# EAGLE schematic NervousSys_V2 (EAGLE 8.5.0)
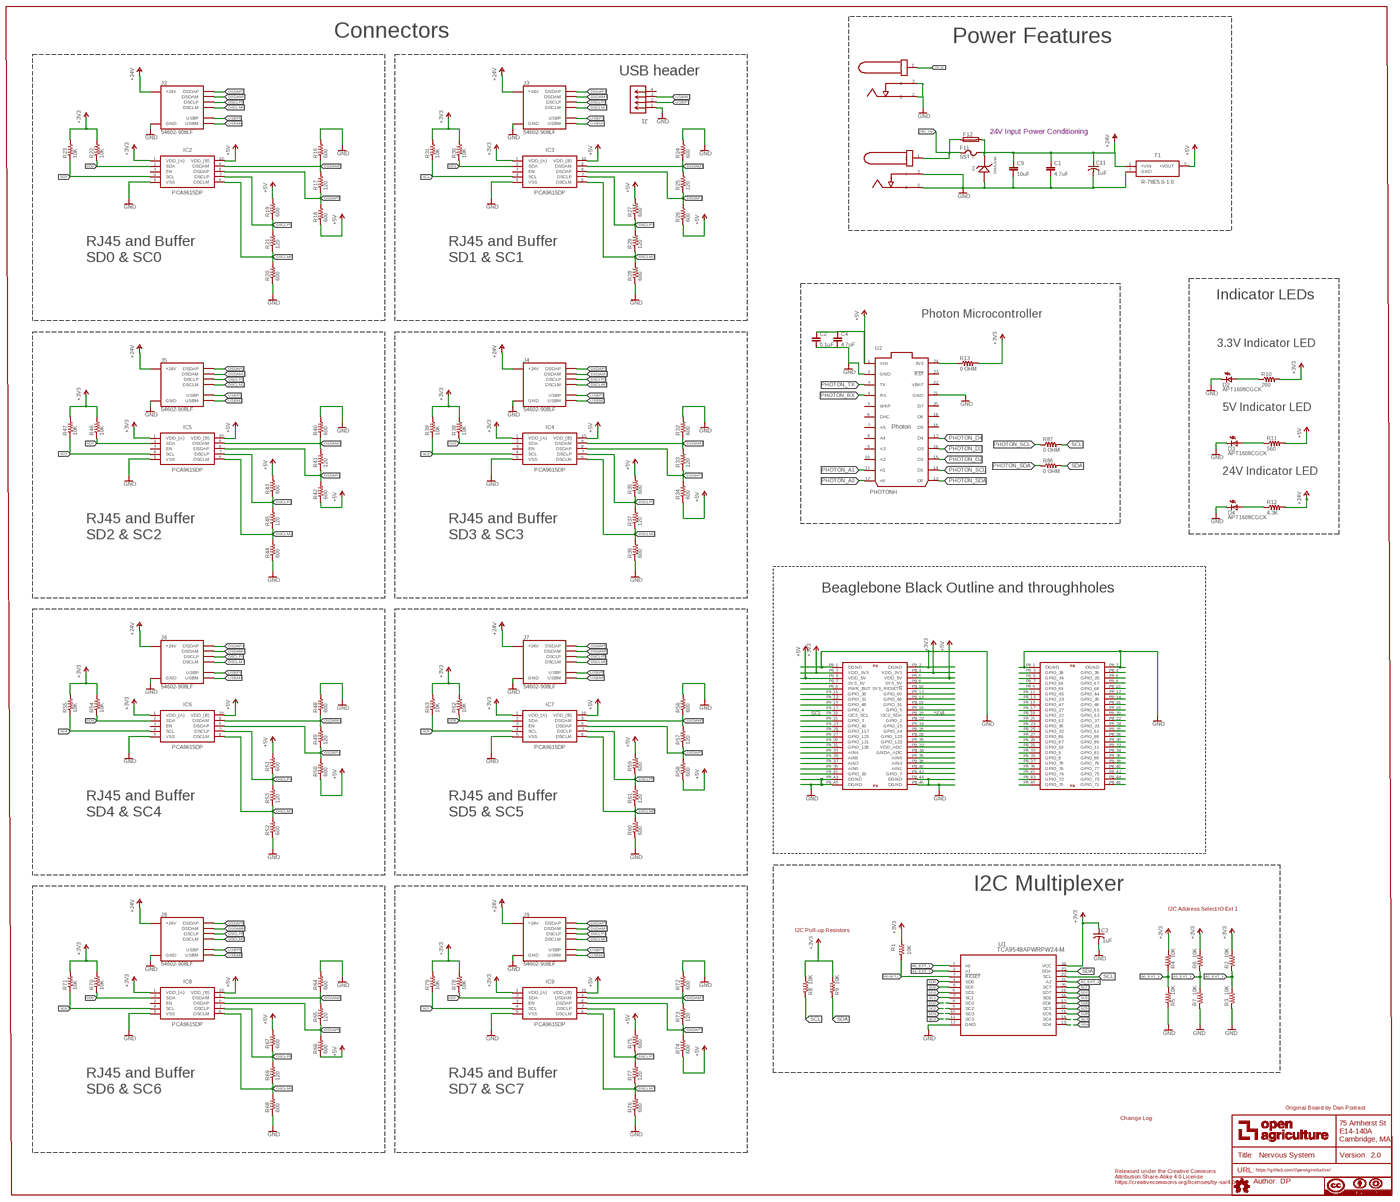
[diagram p0: schematic, sheet 1, overview]
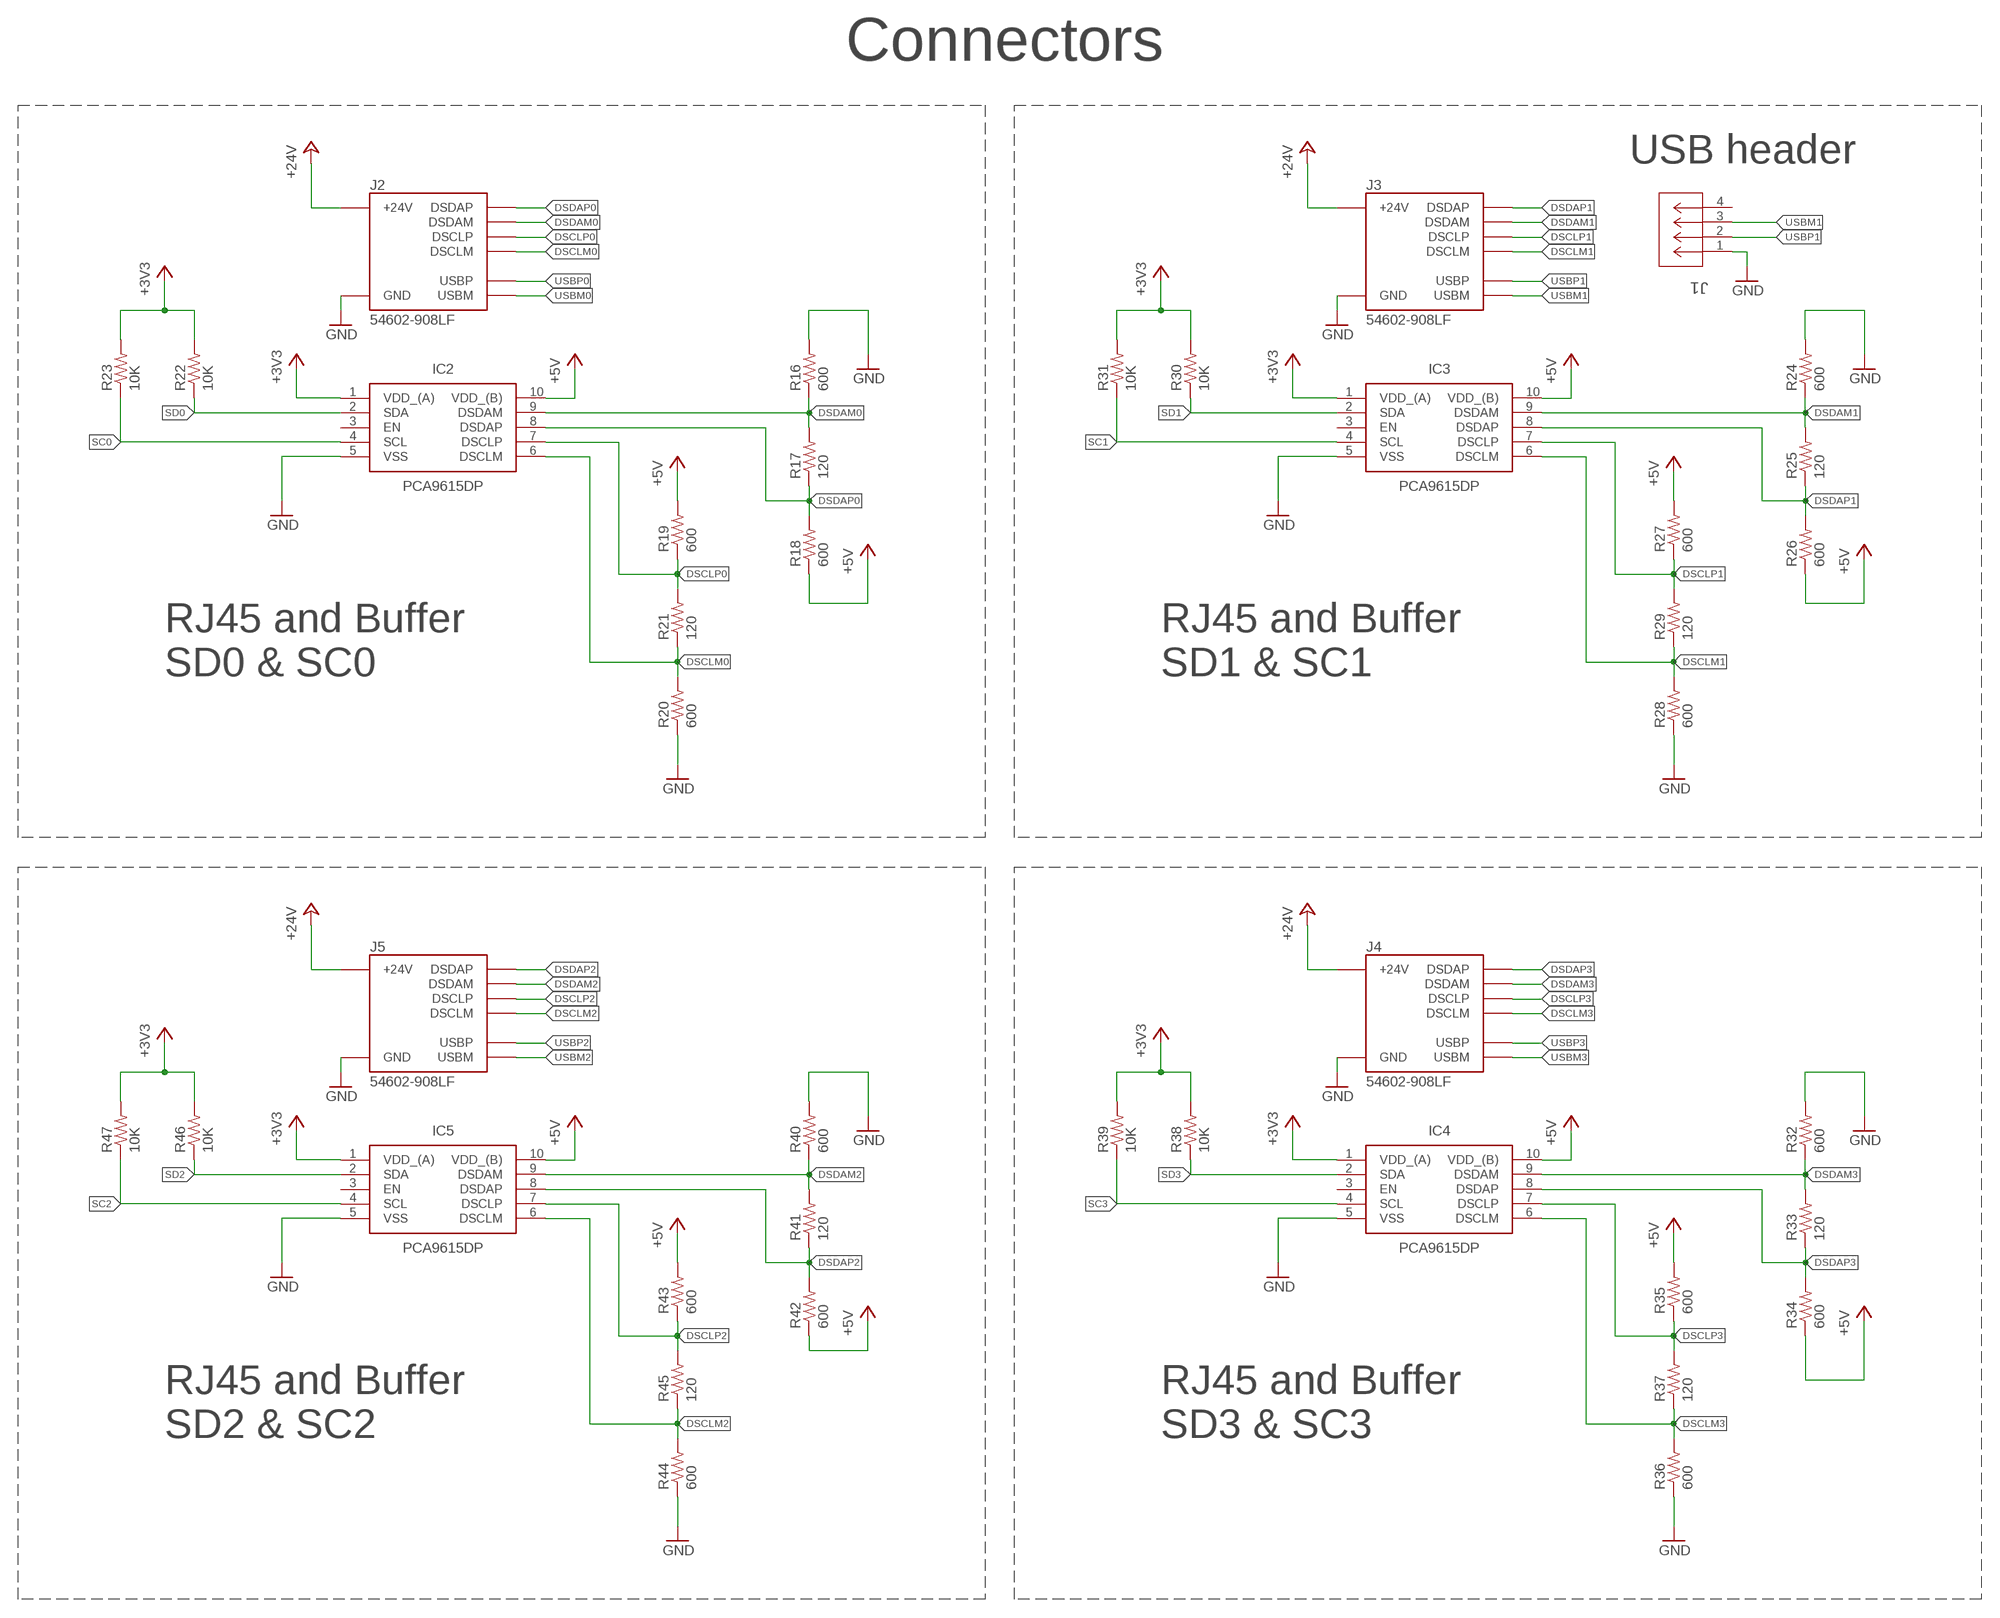
[diagram p1: schematic, sheet 1, part 1 of 4]
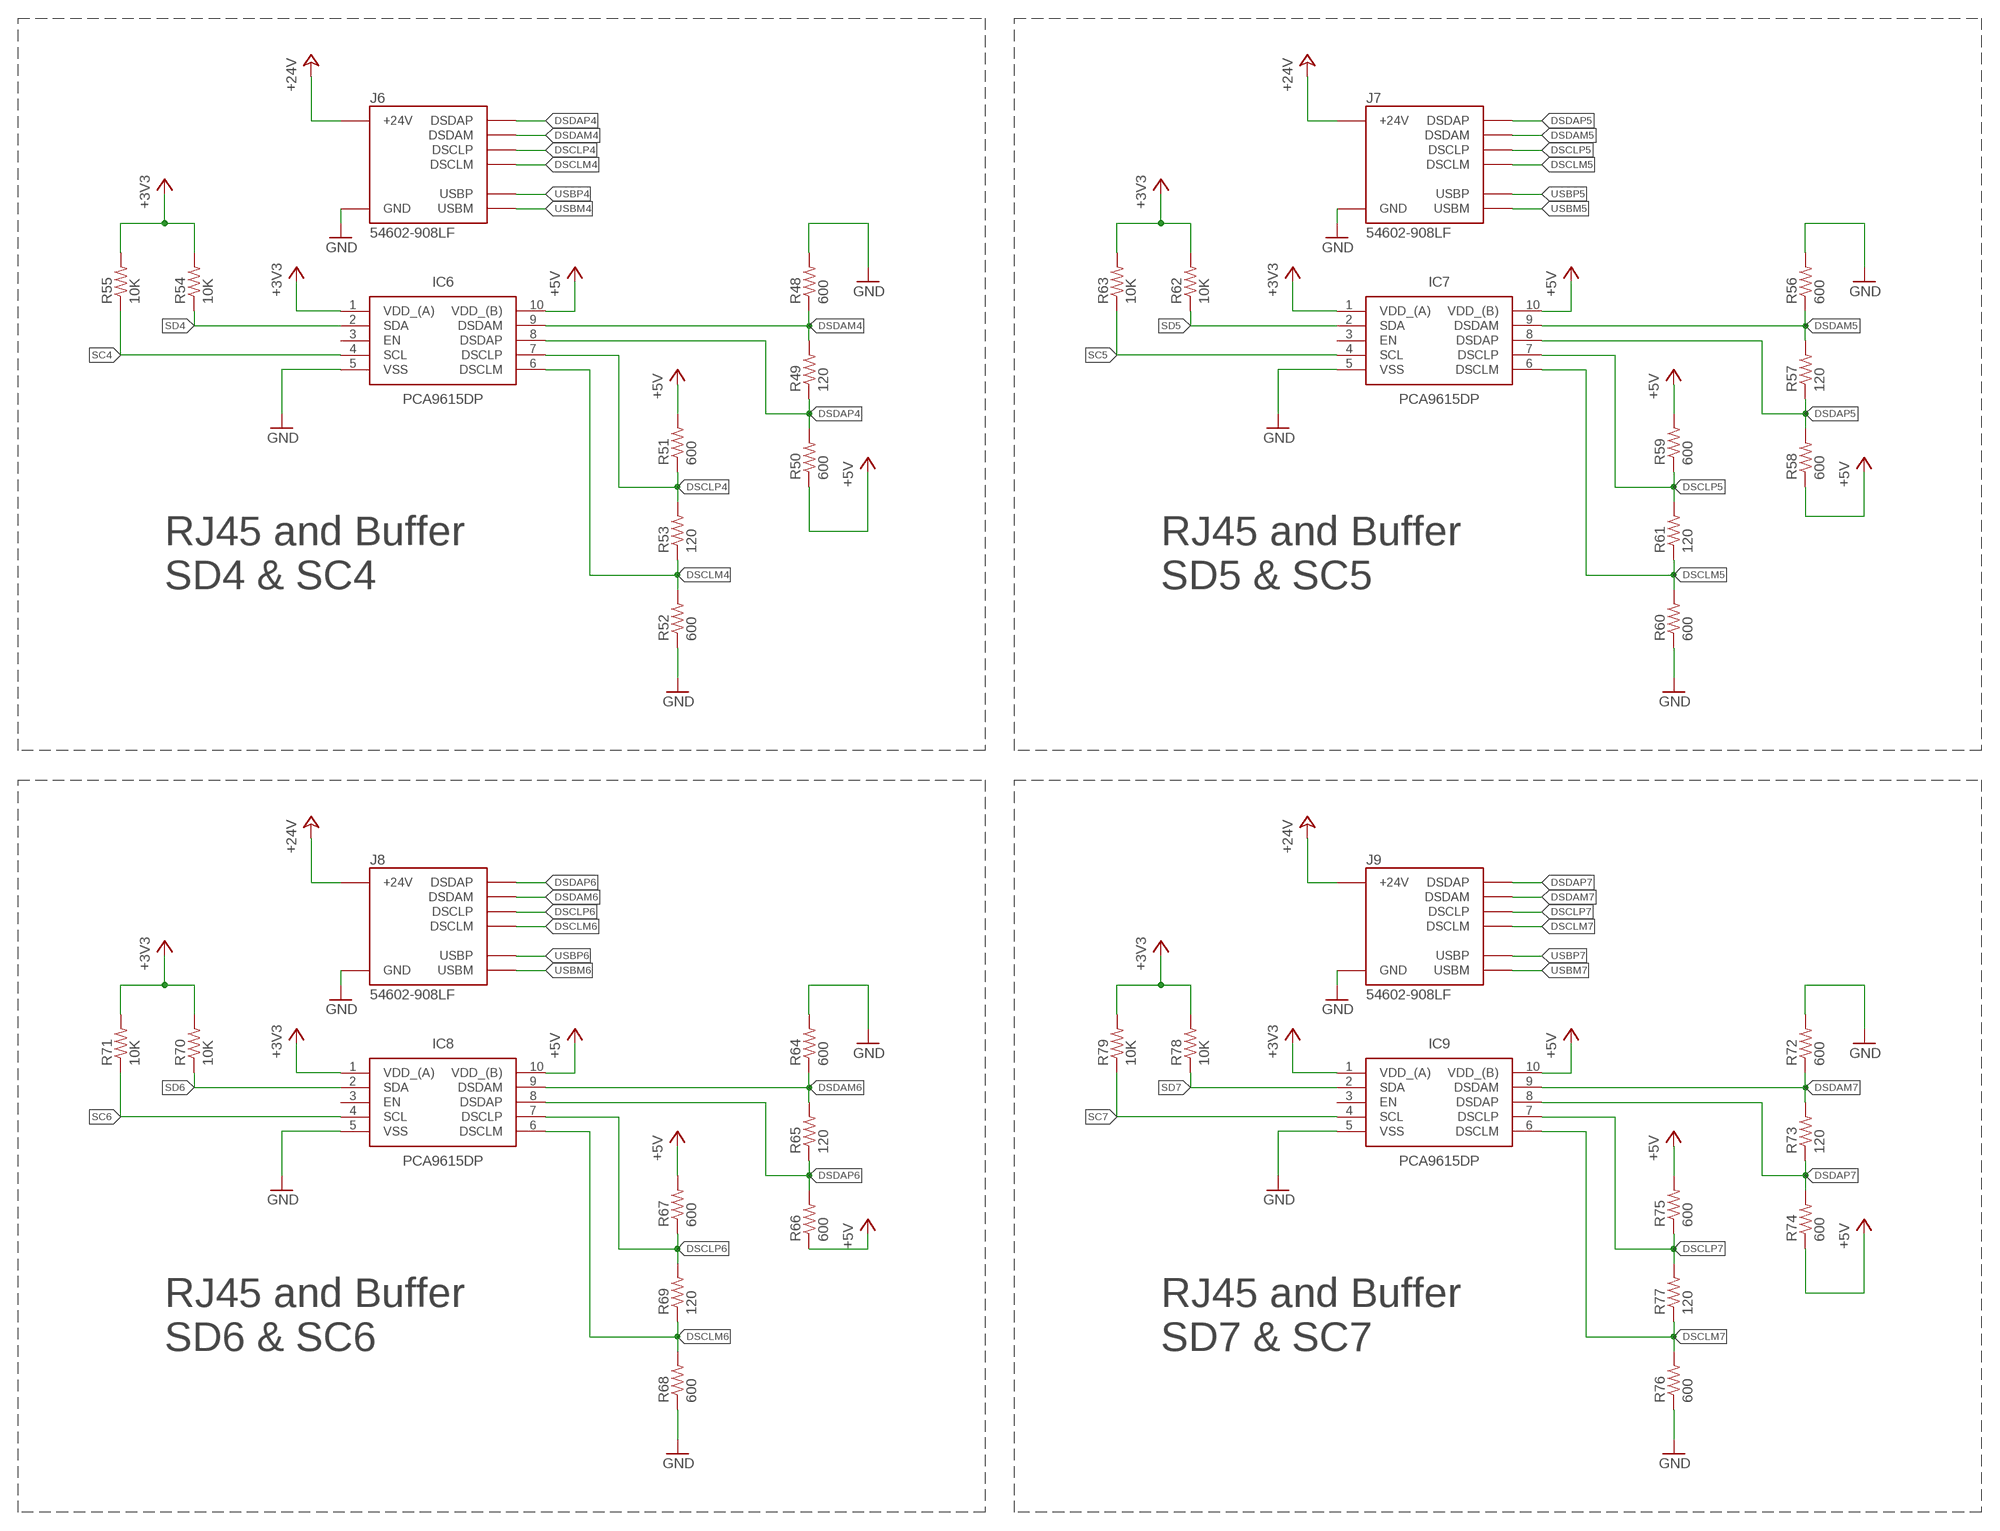
[diagram p2: schematic, sheet 1, part 2 of 4]
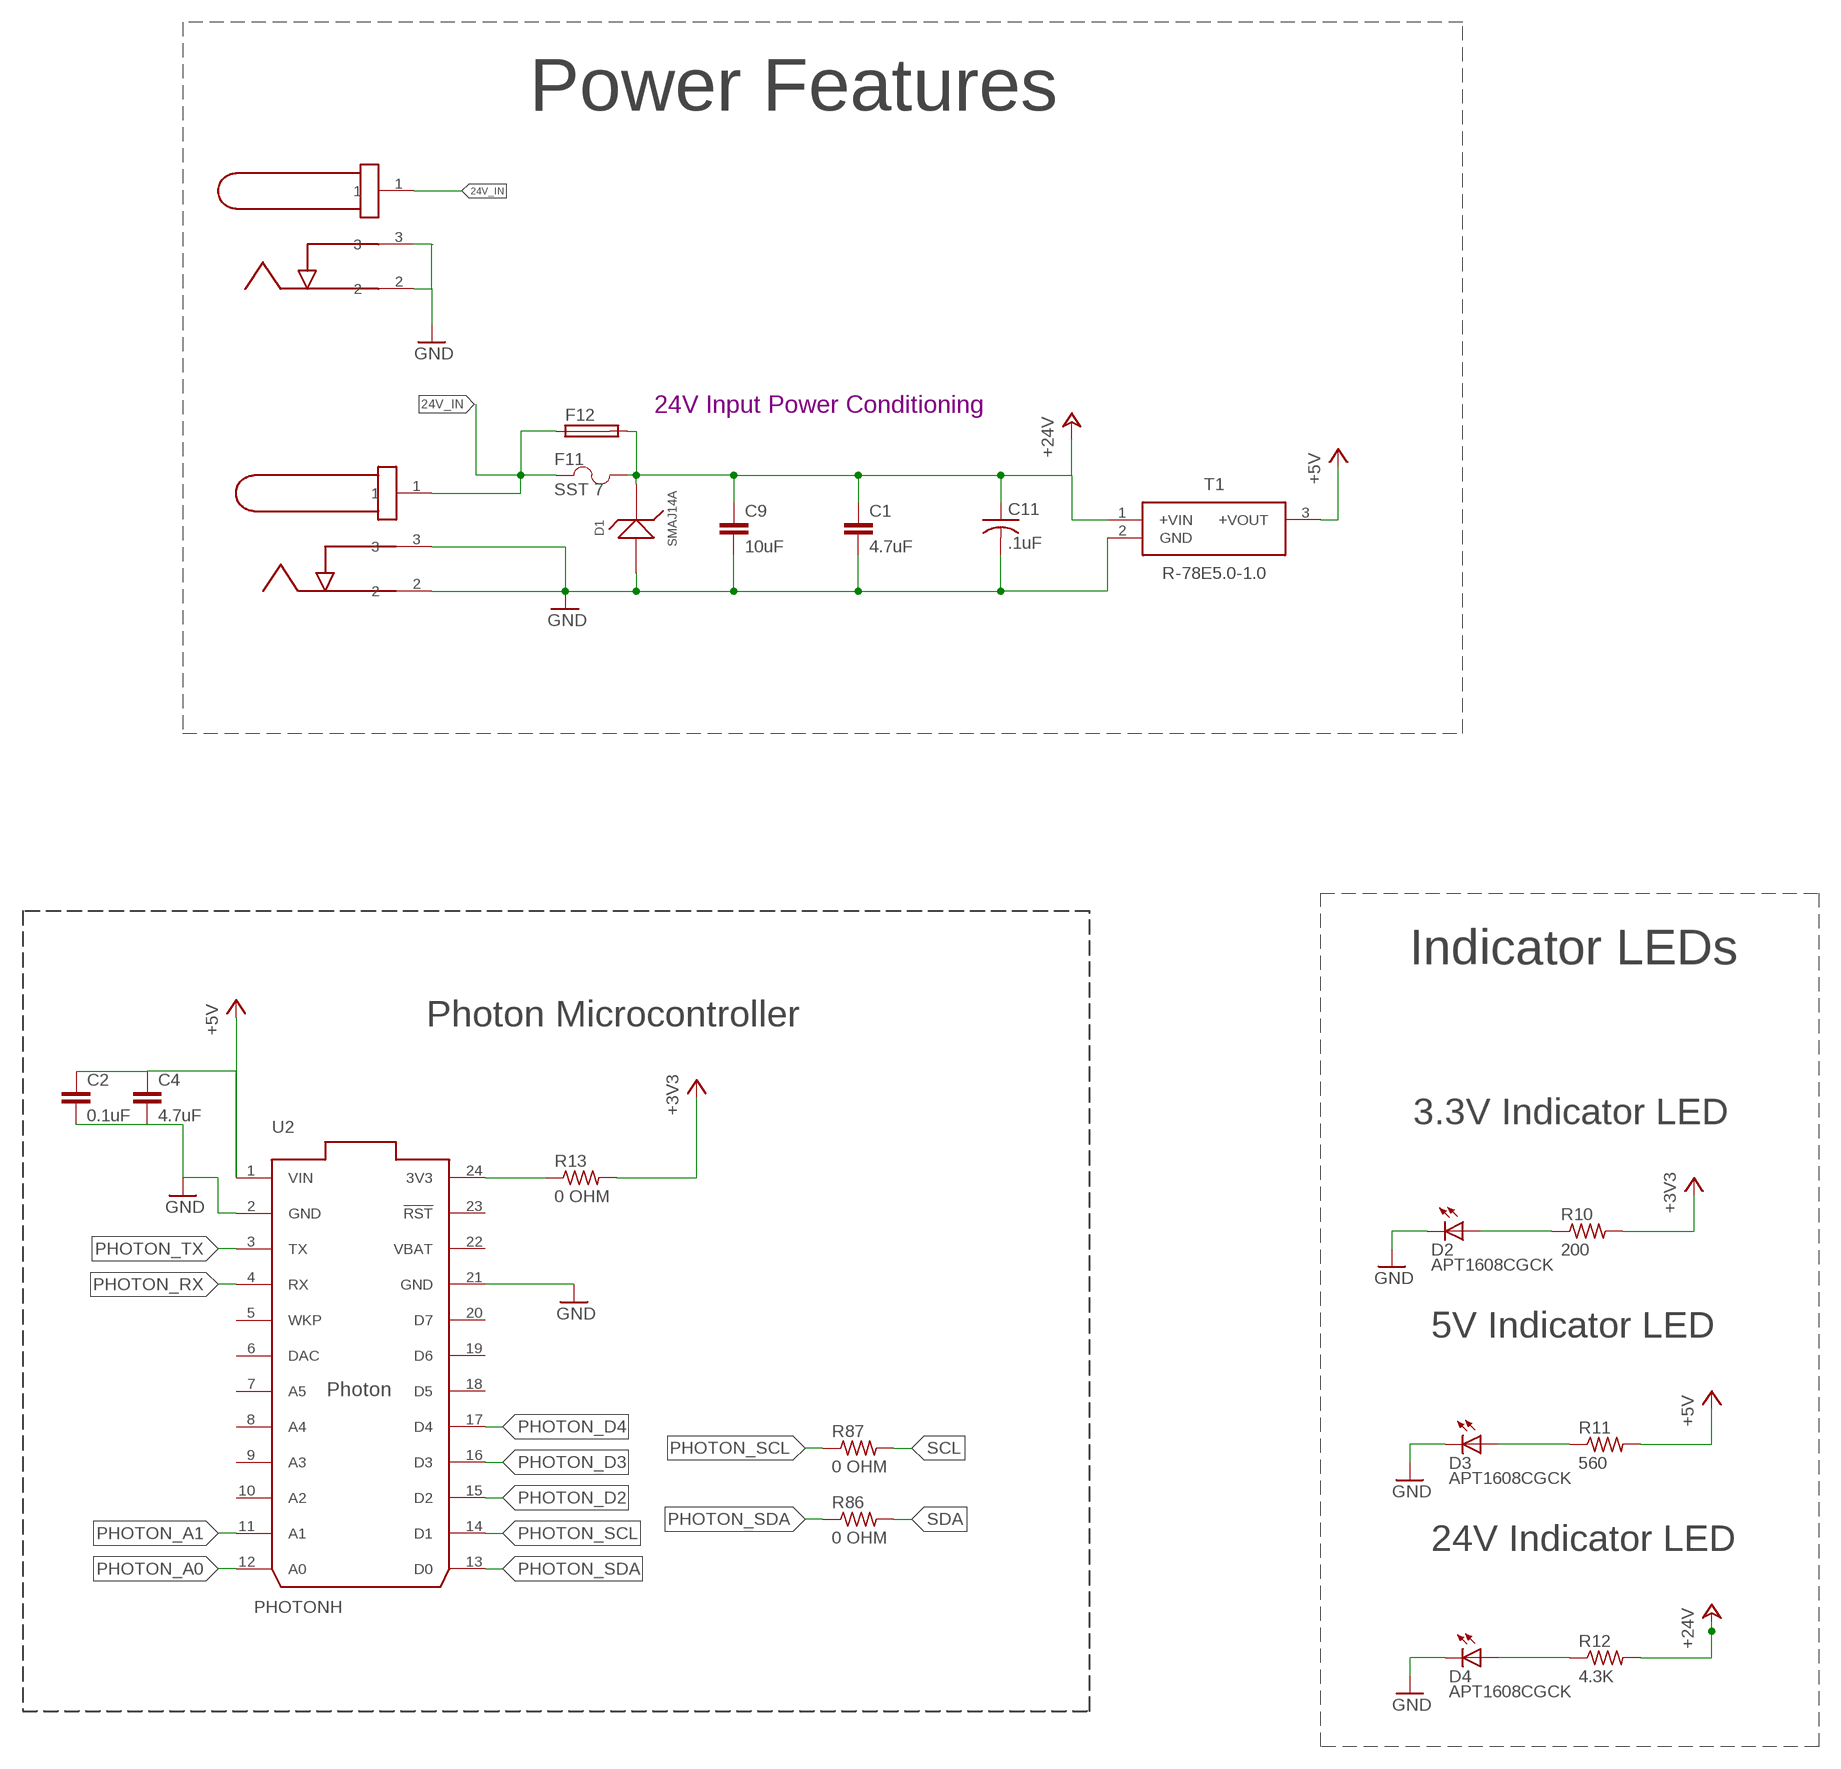
[diagram p3: schematic, sheet 1, part 3 of 4]
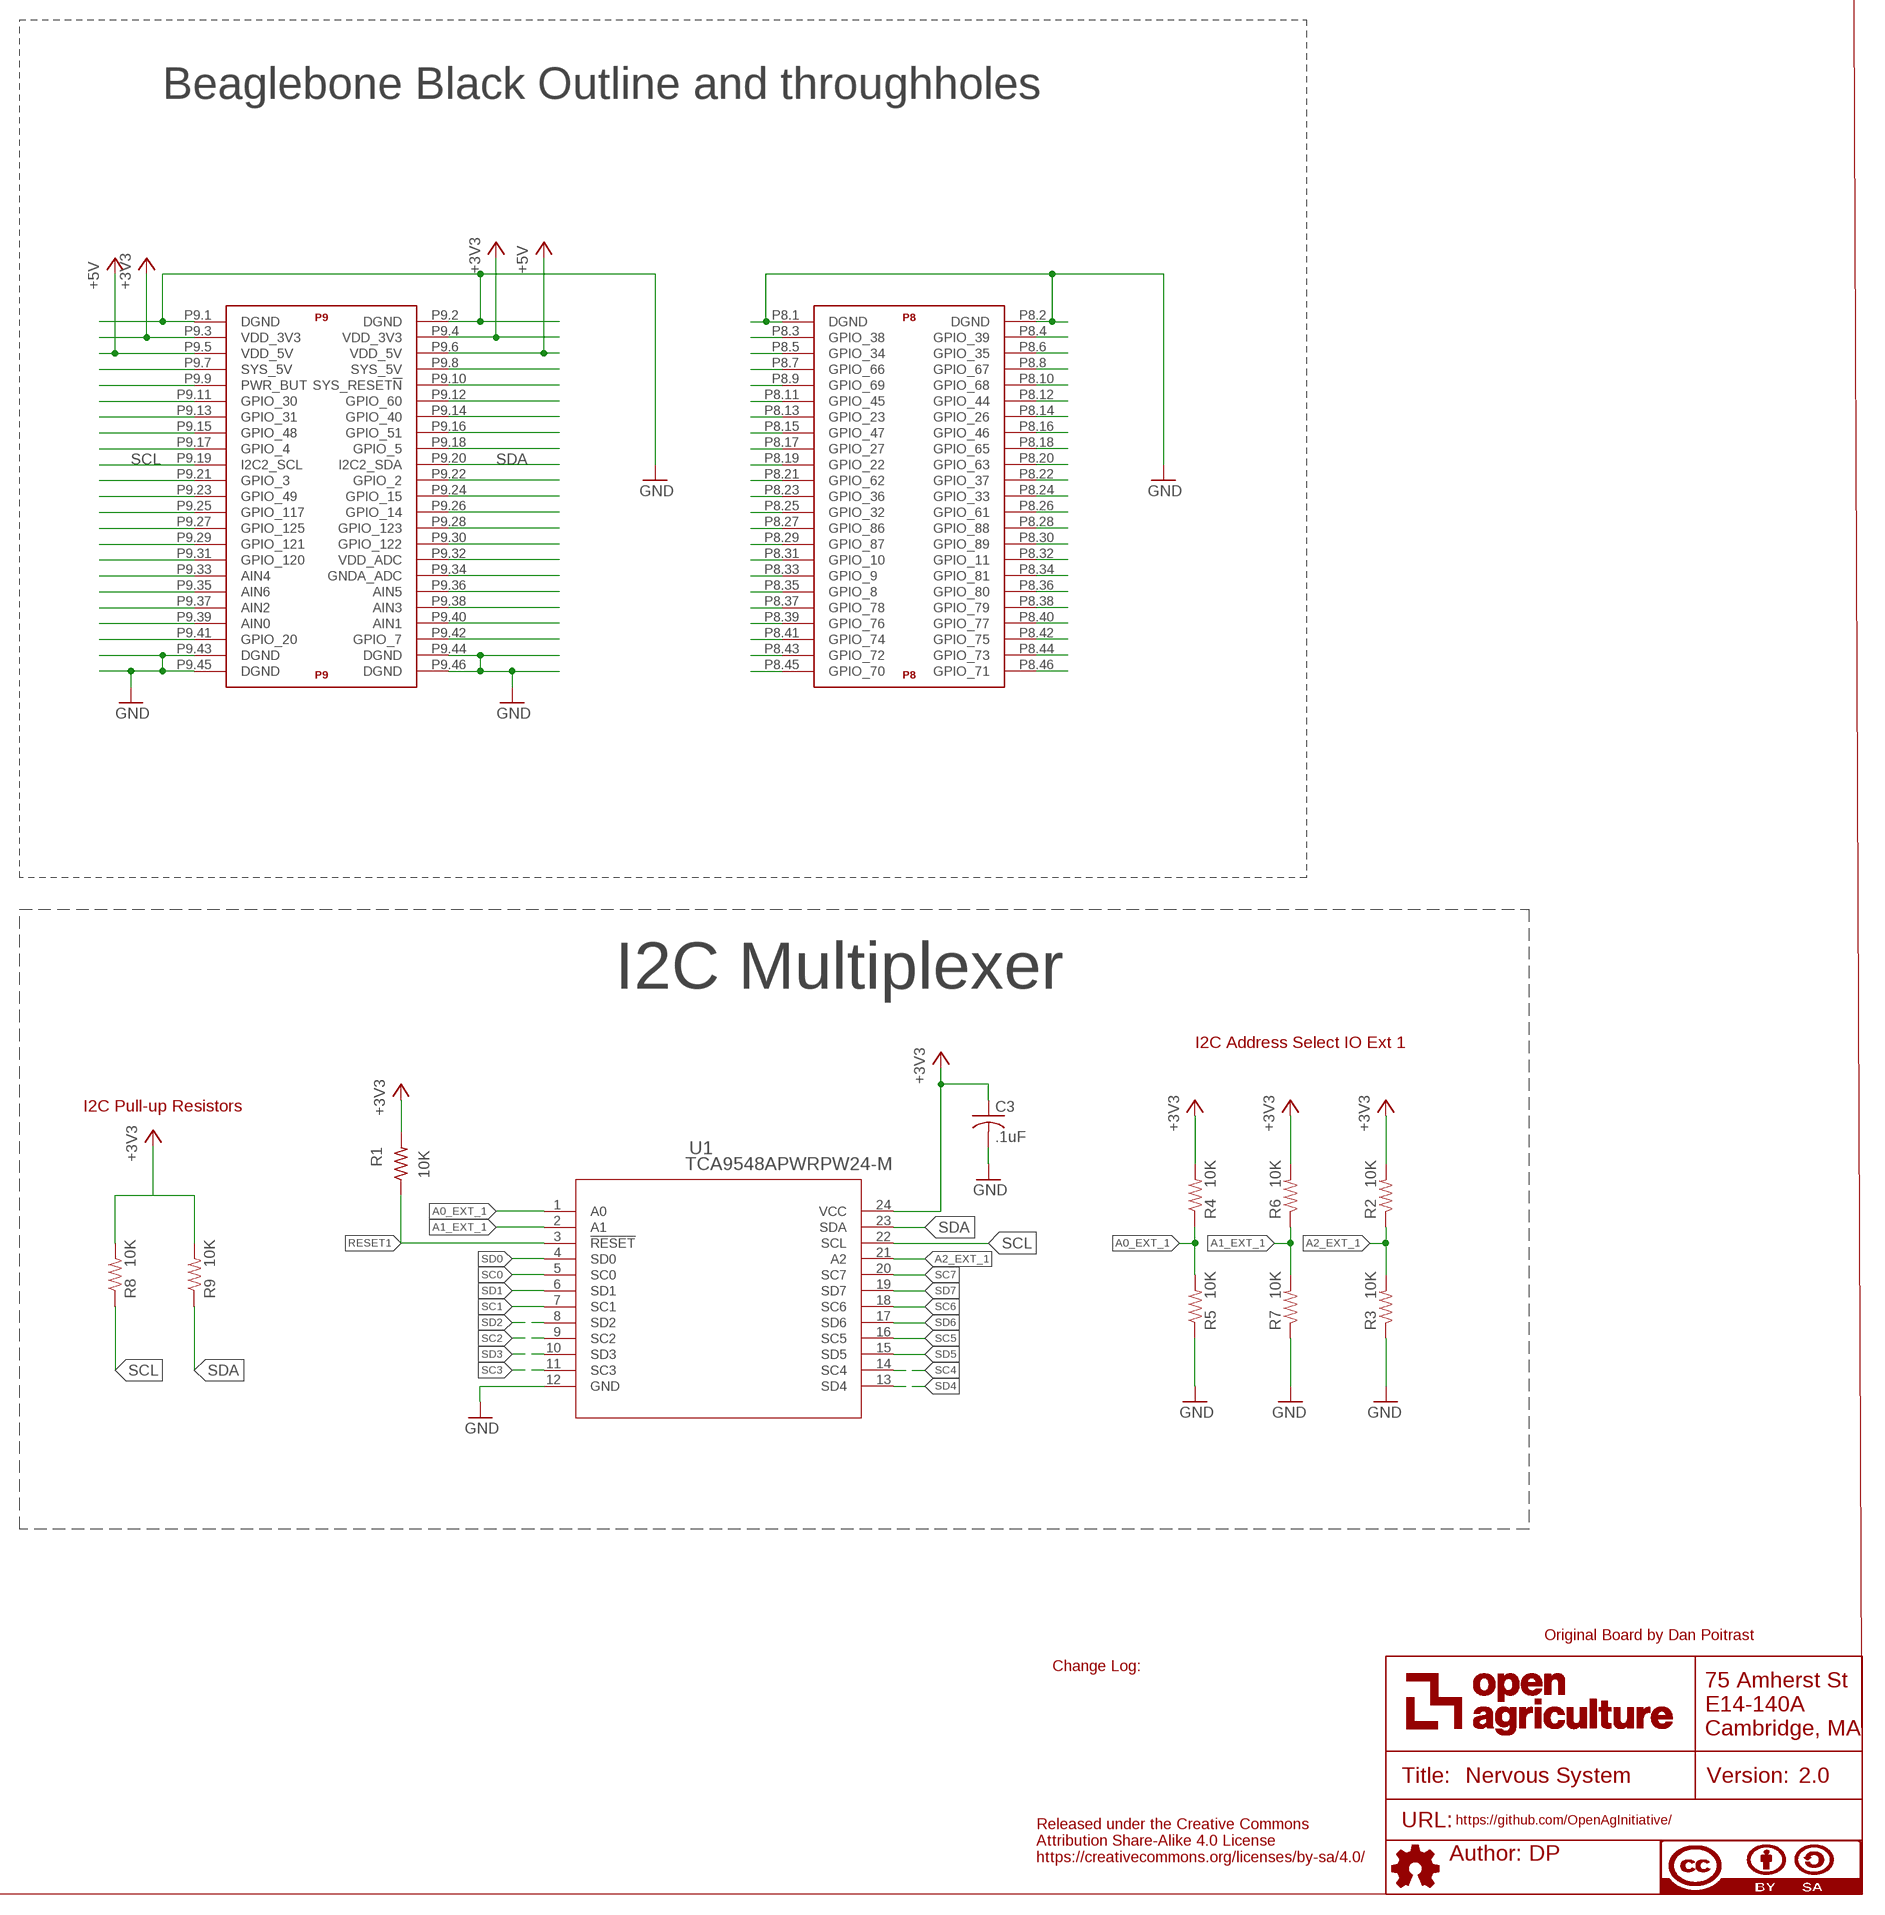
[diagram p4: schematic, sheet 1, part 4 of 4]

## Parts
ATTRIBUTES  DOCFIELD  [DOCFIELD]
C1  4.7uF  4.7UF-C1206C475K5PACTU  [CAP_C1206]
C2  0.1uF  0.1UF-C0603C104K5RACTU  [C0603]
C3  .1uF  C-USC0603  [C0603@1]
C4  4.7uF  4.7UF-CL21A475KBQNNNE  [C0805]
C9  10uF  10UF-CL31B106KBHNNNE  [C1206]
C11  .1uF  C-USC0603  [C0603@1]
D1  SMAJ14A  [DO-214AC]
D2  APT1608CGCK  [CHIPLED_0603]
D3  APT1608CGCK  [CHIPLED_0603]
D4  APT1608CGCK  [CHIPLED_0603]
F11  SST 7  SST_7  [SS]
F12  GSH15  [GSH15]
IC2  PCA9615DP  [SOP50P490X110-10N]
IC3  PCA9615DP  [SOP50P490X110-10N]
IC4  PCA9615DP  [SOP50P490X110-10N]
IC5  PCA9615DP  [SOP50P490X110-10N]
IC6  PCA9615DP  [SOP50P490X110-10N]
IC7  PCA9615DP  [SOP50P490X110-10N]
IC8  PCA9615DP  [SOP50P490X110-10N]
IC9  PCA9615DP  [SOP50P490X110-10N]
J1  87583-2010BLF  [CONN_USB-87583]
J2  54602-908LF  OPENAG-V1-RJ45PTH  [OPENAG-V1-RJ45]
J3  54602-908LF  OPENAG-V1-RJ45PTH  [OPENAG-V1-RJ45]
J4  54602-908LF  OPENAG-V1-RJ45PTH  [OPENAG-V1-RJ45]
J5  54602-908LF  OPENAG-V1-RJ45PTH  [OPENAG-V1-RJ45]
J6  54602-908LF  OPENAG-V1-RJ45PTH  [OPENAG-V1-RJ45]
J7  54602-908LF  OPENAG-V1-RJ45PTH  [OPENAG-V1-RJ45]
J8  54602-908LF  OPENAG-V1-RJ45PTH  [OPENAG-V1-RJ45]
J9  54602-908LF  OPENAG-V1-RJ45PTH  [OPENAG-V1-RJ45]
R1  10K  R-US_R0603  [R0603]
R2  10K  10KOHM-1/10W-1%(0603)0603  [0603-RES]
R3  10K  10KOHM-1/10W-1%(0603)0603  [0603-RES]
R4  10K  10KOHM-1/10W-1%(0603)0603  [0603-RES]
R5  10K  10KOHM-1/10W-1%(0603)0603  [0603-RES]
R6  10K  10KOHM-1/10W-1%(0603)0603  [0603-RES]
R7  10K  10KOHM-1/10W-1%(0603)0603  [0603-RES]
R8  10K  10KOHM-1/10W-1%(0603)0603  [0603-RES]
R9  10K  10KOHM-1/10W-1%(0603)0603  [0603-RES]
R10  200  100OHM-RC0603JR-07100RL  [RC0603N]
R11  560  100OHM-RC0603JR-07100RL  [RC0603N]
R12  4.3K  100OHM-RC0603JR-07100RL  [RC0603N]
R13  0 OHM  0OHM-RC0603JR-070RL  [RC0603N]
R16  600  R-US_R0603  [R0603]
R17  120  R-US_R0603  [R0603]
R18  600  R-US_R0603  [R0603]
R19  600  R-US_R0603  [R0603]
R20  600  R-US_R0603  [R0603]
R21  120  R-US_R0603  [R0603]
R22  10K  R-US_R0603  [R0603]
R23  10K  R-US_R0603  [R0603]
R24  600  R-US_R0603  [R0603]
R25  120  R-US_R0603  [R0603]
R26  600  R-US_R0603  [R0603]
R27  600  R-US_R0603  [R0603]
R28  600  R-US_R0603  [R0603]
R29  120  R-US_R0603  [R0603]
R30  10K  R-US_R0603  [R0603]
R31  10K  R-US_R0603  [R0603]
R32  600  R-US_R0603  [R0603]
R33  120  R-US_R0603  [R0603]
R34  600  R-US_R0603  [R0603]
R35  600  R-US_R0603  [R0603]
R36  600  R-US_R0603  [R0603]
R37  120  R-US_R0603  [R0603]
R38  10K  R-US_R0603  [R0603]
R39  10K  R-US_R0603  [R0603]
R40  600  R-US_R0603  [R0603]
R41  120  R-US_R0603  [R0603]
R42  600  R-US_R0603  [R0603]
R43  600  R-US_R0603  [R0603]
R44  600  R-US_R0603  [R0603]
R45  120  R-US_R0603  [R0603]
R46  10K  R-US_R0603  [R0603]
R47  10K  R-US_R0603  [R0603]
R48  600  R-US_R0603  [R0603]
R49  120  R-US_R0603  [R0603]
R50  600  R-US_R0603  [R0603]
R51  600  R-US_R0603  [R0603]
R52  600  R-US_R0603  [R0603]
R53  120  R-US_R0603  [R0603]
R54  10K  R-US_R0603  [R0603]
R55  10K  R-US_R0603  [R0603]
R56  600  R-US_R0603  [R0603]
R57  120  R-US_R0603  [R0603]
R58  600  R-US_R0603  [R0603]
R59  600  R-US_R0603  [R0603]
R60  600  R-US_R0603  [R0603]
R61  120  R-US_R0603  [R0603]
R62  10K  R-US_R0603  [R0603]
R63  10K  R-US_R0603  [R0603]
R64  600  R-US_R0603  [R0603]
R65  120  R-US_R0603  [R0603]
R66  600  R-US_R0603  [R0603]
R67  600  R-US_R0603  [R0603]
R68  600  R-US_R0603  [R0603]
R69  120  R-US_R0603  [R0603]
R70  10K  R-US_R0603  [R0603]
R71  10K  R-US_R0603  [R0603]
R72  600  R-US_R0603  [R0603]
R73  120  R-US_R0603  [R0603]
R74  600  R-US_R0603  [R0603]
R75  600  R-US_R0603  [R0603]
R76  600  R-US_R0603  [R0603]
R77  120  R-US_R0603  [R0603]
R78  10K  R-US_R0603  [R0603]
R79  10K  R-US_R0603  [R0603]
R86  0 OHM  0OHM-RC0603JR-070RL  [RC0603N]
R87  0 OHM  0OHM-RC0603JR-070RL  [RC0603N]
T1  R-78E5.0-1.0  [R-78E5.0-1.0]
U1  TCA9548APWRPW24-M  [PW24-M]
U2  PHOTONH  PHOTONHPHOTONH  [PHOTON]
U$1  PJ-036AH  [PJ-036AH]
U$2  BEAGLE_BONE_BLACK_CAPE  [BEAGLE_BONE_BLACK_CAPE]
U$3  PJ-036AH  [PJ-036AH]

## Nets
24V_IN: F11.1 F12.1 U$1.1 U$3.1
+3V3: C3.1 IC2.1(VDD_(A)) IC3.1(VDD_(A)) IC4.1(VDD_(A)) IC5.1(VDD_(A)) IC6.1(VDD_(A)) IC7.1(VDD_(A)) IC8.1(VDD_(A)) IC9.1(VDD_(A)) R1.2 R2.2 R4.2 R6.2 R8.2 R9.2 R10.2 R13.2 R22.2 R23.2 R30.2 R31.2 R38.2 R39.2 R46.2 R47.2 R54.2 R55.2 R62.2 R63.2 R70.2 R71.2 R78.2 R79.2 U1.24(VCC) U$2.P9.3(P9:VDD_3V3) U$2.P9.4(P9:VDD_3V3)
+5V: C2.1 C4.1 IC2.10(VDD_(B)) IC3.10(VDD_(B)) IC4.10(VDD_(B)) IC5.10(VDD_(B)) IC6.10(VDD_(B)) IC7.10(VDD_(B)) IC8.10(VDD_(B)) IC9.10(VDD_(B)) R11.2 R18.1 R19.2 R26.1 R27.2 R34.1 R35.2 R42.1 R43.2 R50.1 R51.2 R58.1 R59.2 R66.1 R67.2 R74.1 R75.2 T1.3(+VOUT) U2.1(VIN) U$2.P9.5(P9:VDD_5V) U$2.P9.6(P9:VDD_5V)
+24V: C1.1 C9.1 C11.1 D1.C F11.2 F12.2 J2.24V(6)(+24V) J3.24V(6)(+24V) J4.24V(6)(+24V) J5.24V(6)(+24V) J6.24V(6)(+24V) J7.24V(6)(+24V) J8.24V(6)(+24V) J9.24V(6)(+24V) R12.2 T1.1(+VIN)
A0_EXT_1: R4.1 R5.2 U1.1(A0)
A1_EXT_1: R6.1 R7.2 U1.2(A1)
A2_EXT_1: R2.1 R3.2 U1.21(A2)
DSCLM0: IC2.6(DSCLM) J2.DSCLM(5)(DSCLM) R20.2 R21.1
DSCLM1: IC3.6(DSCLM) J3.DSCLM(5)(DSCLM) R28.2 R29.1
DSCLM2: IC5.6(DSCLM) J5.DSCLM(5)(DSCLM) R44.2 R45.1
DSCLM3: IC4.6(DSCLM) J4.DSCLM(5)(DSCLM) R36.2 R37.1
DSCLM4: IC6.6(DSCLM) J6.DSCLM(5)(DSCLM) R52.2 R53.1
DSCLM5: IC7.6(DSCLM) J7.DSCLM(5)(DSCLM) R60.2 R61.1
DSCLM6: IC8.6(DSCLM) J8.DSCLM(5)(DSCLM) R68.2 R69.1
DSCLM7: IC9.6(DSCLM) J9.DSCLM(5)(DSCLM) R76.2 R77.1
DSCLP0: IC2.7(DSCLP) J2.DSCLP(4)(DSCLP) R19.1 R21.2
DSCLP1: IC3.7(DSCLP) J3.DSCLP(4)(DSCLP) R27.1 R29.2
DSCLP2: IC5.7(DSCLP) J5.DSCLP(4)(DSCLP) R43.1 R45.2
DSCLP3: IC4.7(DSCLP) J4.DSCLP(4)(DSCLP) R35.1 R37.2
DSCLP4: IC6.7(DSCLP) J6.DSCLP(4)(DSCLP) R51.1 R53.2
DSCLP5: IC7.7(DSCLP) J7.DSCLP(4)(DSCLP) R59.1 R61.2
DSCLP6: IC8.7(DSCLP) J8.DSCLP(4)(DSCLP) R67.1 R69.2
DSCLP7: IC9.7(DSCLP) J9.DSCLP(4)(DSCLP) R75.1 R77.2
DSDAM0: IC2.9(DSDAM) J2.DSDAM(2)(DSDAM) R16.1 R17.2
DSDAM1: IC3.9(DSDAM) J3.DSDAM(2)(DSDAM) R24.1 R25.2
DSDAM2: IC5.9(DSDAM) J5.DSDAM(2)(DSDAM) R40.1 R41.2
DSDAM3: IC4.9(DSDAM) J4.DSDAM(2)(DSDAM) R32.1 R33.2
DSDAM4: IC6.9(DSDAM) J6.DSDAM(2)(DSDAM) R48.1 R49.2
DSDAM5: IC7.9(DSDAM) J7.DSDAM(2)(DSDAM) R56.1 R57.2
DSDAM6: IC8.9(DSDAM) J8.DSDAM(2)(DSDAM) R64.1 R65.2
DSDAM7: IC9.9(DSDAM) J9.DSDAM(2)(DSDAM) R72.1 R73.2
DSDAP0: IC2.8(DSDAP) J2.DSDAP(1)(DSDAP) R17.1 R18.2
DSDAP1: IC3.8(DSDAP) J3.DSDAP(1)(DSDAP) R25.1 R26.2
DSDAP2: IC5.8(DSDAP) J5.DSDAP(1)(DSDAP) R41.1 R42.2
DSDAP3: IC4.8(DSDAP) J4.DSDAP(1)(DSDAP) R33.1 R34.2
DSDAP4: IC6.8(DSDAP) J6.DSDAP(1)(DSDAP) R49.1 R50.2
DSDAP5: IC7.8(DSDAP) J7.DSDAP(1)(DSDAP) R57.1 R58.2
DSDAP6: IC8.8(DSDAP) J8.DSDAP(1)(DSDAP) R65.1 R66.2
DSDAP7: IC9.8(DSDAP) J9.DSDAP(1)(DSDAP) R73.1 R74.2
GND: C1.2 C2.2 C3.2 C4.2 C9.2 C11.2 D1.A D2.C D3.C D4.C IC2.5(VSS) IC3.5(VSS) IC4.5(VSS) IC5.5(VSS) IC6.5(VSS) IC7.5(VSS) IC8.5(VSS) IC9.5(VSS) J1.1 J2.GND(3)(GND) J3.GND(3)(GND) J4.GND(3)(GND) J5.GND(3)(GND) J6.GND(3)(GND) J7.GND(3)(GND) J8.GND(3)(GND) J9.GND(3)(GND) R3.1 R5.1 R7.1 R16.2 R20.1 R24.2 R28.1 R32.2 R36.1 R40.2 R44.1 R48.2 R52.1 R56.2 R60.1 R64.2 R68.1 R72.2 R76.1 T1.2(GND) U1.12(GND) U2.2(GND) U2.21(GND) U$1.2 U$1.3 U$2.P8.1(P8:DGND) U$2.P8.2(P8:DGND) U$2.P9.1(P9:DGND) U$2.P9.2(P9:DGND) U$2.P9.43(P9:DGND) U$2.P9.44(P9:DGND) U$2.P9.45(P9:DGND) U$2.P9.46(P9:DGND) U$3.2 U$3.3
N$1: U$2.P8.45(P8:GPIO_70)
N$2: D3.A R11.1
N$3: U$2.P8.43(P8:GPIO_72)
N$4: D4.A R12.1
N$5: R13.1 U2.24(3V3)
N$6: U$2.P8.41(P8:GPIO_74)
N$7: U$2.P8.39(P8:GPIO_76)
N$8: U$2.P8.37(P8:GPIO_78)
N$10: U$2.P8.35(P8:GPIO_8)
N$11: U$2.P8.33(P8:GPIO_9)
N$12: D2.A R10.1
N$30: U$2.P8.31(P8:GPIO_10)
N$53: U$2.P8.29(P8:GPIO_87)
N$54: U$2.P8.27(P8:GPIO_86)
N$55: U$2.P8.25(P8:GPIO_32)
N$67: U$2.P8.23(P8:GPIO_36)
N$74: U$2.P8.21(P8:GPIO_62)
N$75: U$2.P8.19(P8:GPIO_22)
N$76: U$2.P8.17(P8:GPIO_27)
N$77: U$2.P8.15(P8:GPIO_47)
N$78: U$2.P8.13(P8:GPIO_23)
N$90: U$2.P8.11(P8:GPIO_45)
N$97: U$2.P8.9(P8:GPIO_69)
N$98: U$2.P8.7(P8:GPIO_66)
N$99: U$2.P8.5(P8:GPIO_34)
N$100: U$2.P8.3(P8:GPIO_38)
N$101: U$2.P8.46(P8:GPIO_71)
N$102: U$2.P8.44(P8:GPIO_73)
N$103: U$2.P8.42(P8:GPIO_75)
N$104: U$2.P8.40(P8:GPIO_77)
N$105: U$2.P8.38(P8:GPIO_79)
N$106: U$2.P8.36(P8:GPIO_80)
N$107: U$2.P8.34(P8:GPIO_81)
N$108: U$2.P8.32(P8:GPIO_11)
N$109: U$2.P8.30(P8:GPIO_89)
N$110: U$2.P8.28(P8:GPIO_88)
N$111: U$2.P8.26(P8:GPIO_61)
N$112: U$2.P8.24(P8:GPIO_33)
N$113: U$2.P8.22(P8:GPIO_37)
N$114: U$2.P8.20(P8:GPIO_63)
N$115: U$2.P8.18(P8:GPIO_65)
N$116: U$2.P8.16(P8:GPIO_46)
N$117: U$2.P8.14(P8:GPIO_26)
N$118: U$2.P8.12(P8:GPIO_44)
N$119: U$2.P8.10(P8:GPIO_68)
N$120: U$2.P8.8(P8:GPIO_67)
N$121: U$2.P8.6(P8:GPIO_35)
N$122: U$2.P8.4(P8:GPIO_39)
N$123: U$2.P9.42(P9:GPIO_7)
N$124: U$2.P9.40(P9:AIN1)
N$125: U$2.P9.38(P9:AIN3)
N$126: U$2.P9.36(P9:AIN5)
N$127: U$2.P9.34(P9:GNDA_ADC)
N$128: U$2.P9.32(P9:VDD_ADC)
N$129: U$2.P9.30(P9:GPIO_122)
N$130: U$2.P9.28(P9:GPIO_123)
N$131: U$2.P9.26(P9:GPIO_14)
N$132: U$2.P9.24(P9:GPIO_15)
N$133: U$2.P9.22(P9:GPIO_2)
N$134: U$2.P9.18(P9:GPIO_5)
N$135: U$2.P9.16(P9:GPIO_51)
N$136: U$2.P9.14(P9:GPIO_40)
N$137: U$2.P9.12(P9:GPIO_60)
N$138: U$2.P9.10(P9:SYS_RESET!N)
N$139: U$2.P9.8(P9:SYS_5V)
N$140: U$2.P9.41(P9:GPIO_20)
N$141: U$2.P9.39(P9:AIN0)
N$142: U$2.P9.37(P9:AIN2)
N$143: U$2.P9.35(P9:AIN6)
N$144: U$2.P9.33(P9:AIN4)
N$145: U$2.P9.31(P9:GPIO_120)
N$146: U$2.P9.29(P9:GPIO_121)
N$147: U$2.P9.27(P9:GPIO_125)
N$148: U$2.P9.25(P9:GPIO_117)
N$149: U$2.P9.23(P9:GPIO_49)
N$150: U$2.P9.21(P9:GPIO_3)
N$151: U$2.P9.17(P9:GPIO_4)
N$152: U$2.P9.15(P9:GPIO_48)
N$153: U$2.P9.13(P9:GPIO_31)
N$154: U$2.P9.11(P9:GPIO_30)
N$155: U$2.P9.9(P9:PWR_BUT)
N$156: U$2.P9.7(P9:SYS_5V)
PHOTON_A0: U2.12(A0)
PHOTON_A1: U2.11(A1)
PHOTON_D2: U2.15(D2)
PHOTON_D3: U2.16(D3)
PHOTON_D4: U2.17(D4)
PHOTON_RX: U2.4(RX)
PHOTON_SCL: R87.1 U2.14(D1)
PHOTON_SDA: R86.1 U2.13(D0)
PHOTON_TX: U2.3(TX)
RESET1: R1.1 U1.3(!RESET)
SC0: IC2.4(SCL) R23.1 U1.5(SC0)
SC1: IC3.4(SCL) R31.1 U1.7(SC1)
SC2: IC5.4(SCL) R47.1 U1.9(SC2)
SC3: IC4.4(SCL) R39.1 U1.11(SC3)
SC4: IC6.4(SCL) R55.1 U1.14(SC4)
SC5: IC7.4(SCL) R63.1 U1.16(SC5)
SC6: IC8.4(SCL) R71.1 U1.18(SC6)
SC7: IC9.4(SCL) R79.1 U1.20(SC7)
SCL: R8.1 R87.2 U1.22(SCL) U$2.P9.19(P9:I2C2_SCL)
SD0: IC2.2(SDA) R22.1 U1.4(SD0)
SD1: IC3.2(SDA) R30.1 U1.6(SD1)
SD2: IC5.2(SDA) R46.1 U1.8(SD2)
SD3: IC4.2(SDA) R38.1 U1.10(SD3)
SD4: IC6.2(SDA) R54.1 U1.13(SD4)
SD5: IC7.2(SDA) R62.1 U1.15(SD5)
SD6: IC8.2(SDA) R70.1 U1.17(SD6)
SD7: IC9.2(SDA) R78.1 U1.19(SD7)
SDA: R9.1 R86.2 U1.23(SDA) U$2.P9.20(P9:I2C2_SDA)
USBM0: J2.USBM(8)(USBM)
USBM1: J1.3 J3.USBM(8)(USBM)
USBM2: J5.USBM(8)(USBM)
USBM3: J4.USBM(8)(USBM)
USBM4: J6.USBM(8)(USBM)
USBM5: J7.USBM(8)(USBM)
USBM6: J8.USBM(8)(USBM)
USBM7: J9.USBM(8)(USBM)
USBP0: J2.USBP(7)(USBP)
USBP1: J1.2 J3.USBP(7)(USBP)
USBP2: J5.USBP(7)(USBP)
USBP3: J4.USBP(7)(USBP)
USBP4: J6.USBP(7)(USBP)
USBP5: J7.USBP(7)(USBP)
USBP6: J8.USBP(7)(USBP)
USBP7: J9.USBP(7)(USBP)
Unconnected: IC2.3(EN) IC3.3(EN) IC4.3(EN) IC5.3(EN) IC6.3(EN) IC7.3(EN) IC8.3(EN) IC9.3(EN) J1.4 U2.5(WKP) U2.6(DAC) U2.7(A5) U2.8(A4) U2.9(A3) U2.10(A2) U2.18(D5) U2.19(D6) U2.20(D7) U2.23(!RST)

## Notes on the sheet
- Connectors | Power Features
- USB header
- 24V Input Power Conditioning
- RJ45 and Buffer
  SD0 & SC0
- RJ45 and Buffer
  SD1 & SC1
- Indicator LEDs
- Photon Microcontroller
- 3.3V Indicator LED
- 5V Indicator LED
- 24V Indicator LED
- RJ45 and Buffer
  SD2 & SC2
- RJ45 and Buffer
  SD3 & SC3
- Beaglebone Black Outline and throughholes
- RJ45 and Buffer
  SD4 & SC4
- RJ45 and Buffer
  SD5 & SC5
- I2C Multiplexer
- I2C Address Select IO Ext 1
- I2C Pull-up Resistors
- RJ45 and Buffer
  SD6 & SC6
- RJ45 and Buffer
  SD7 & SC7
- Original Board by Dan Poitrast
- Change Log:
- Released under the Creative Commons
  Attribution Share-Alike 4.0 License
  https://creativecommons.org/licenses/by-sa/4.0/

## Power pins joined to a net without a drawn wire
VBAT: U2.22(VBAT)

## Library data of the parts
ATTRIBUTES = openag-frames:DOCFIELD: DOCUMENT FIELD; AUTHOR: DP; DESCRIPTION: Nervous System; TITLE: Nervous System; URL: https://github.com/OpenAgInitiative/; VER: 2.0
C1 = openag-capacitors:4.7UF-C1206C475K5PACTU: Kemet - C1206C475K5PACTU - CAP CER 4.7UF 50V X5R 1206 Description: 4.7�F �10% 50V Ceramic Capacitor X5R 1206 (3216 Metric) Technical Specifications: Capacitance: 4.7uF Tolerance: ±10% Rated Voltage: 50V Temperature Coefficient: X5R Operating Temperature: -55°C ~ 85°C Package/Case: 1206 (3216 Metric) Datasheet(s): https://media.digikey.com/pdf/Data%20Sheets/Kemet%20PDFs/C1206C475K5PAC.pdf Vendor(s): Digikey: 399-5507-1-ND <https://www.digikey.com/product-detail/en/kemet/C1206C475K5PACTU/399-5507-1-ND/1950685>; POPULATE: YES; VERIFIED: NO
C2 = openag-capacitors:0.1UF-C0603C104K5RACTU: Kemet - C0603C104K5RACTU - CAP CER 0.1UF 50V X7R 0603 Description: 0.1µF ±10% 50V Ceramic Capacitor X7R 0603 (1608 Metric) Technical Specifications: Capacitance: 0.1µF Tolerance: ±10% Rated Voltage: 50V Temperature Coefficient: X7R Operating Temperature: -55°C ~ 125°C Package / Case: 0603 (1608 Metric) Datasheet(s): X7R Dielectric, 6.3-250 VDC <https://search.kemet.com/component-edge/download/datasheet/C0603C104K5RACTU.pdf> Vendor(s): Digikey: 399-5089-1-ND <https://www.digikey.com/product-detail/en/kemet/C0603C104K5RACTU/399-5089-1-ND/1465623>; POPULATE: YES; VERIFIED: NO
C3 C11 = rcl:C-US: CAPACITOR, American symbol
C4 = openag-capacitors:4.7UF-CL21A475KBQNNNE: Samsung - CL21A475KBQNNNE - CAP CER 4.7UF 50V X5R 0805 Description: 4.7µF ±10% 50V Ceramic Capacitor X5R 0805 (2012 Metric) Technical Specifications: Capacitance: 4.7uF Tolerance: ±10% Rated Voltage: 50V Temperature Coefficient: X5R Operating Temperature: -55°C ~ 85°C Package/Case: 0805 (2012 Metric) Datasheet(s): CL21A475KBQNNNE Characteristics <http://www.samsungsem.com/kr/front/downloadcms.do?path=/kr/support/product-search/mlcc/__icsFiles/afieldfile/2014/11/05&fileName=C_CL21A475KBQNNNE.pdf> Vendor(s): Digikey: 1276-1248-1-ND <https://www.digikey.com/product-detail/en/samsung-electro-mechanics/CL21A475KBQNNNE/1276-1248-1-ND/3889334>; POPULATE: YES; VERIFIED: NO
C9 = openag-capacitors:10UF-CL31B106KBHNNNE: Samsung - CL31B106KBHNNNE - CAP CER 10UF 50V X7R 1206 Description: 10�F �10% 50V Ceramic Capacitor X7R 1206 (3216 Metric) Technical Specifications: Capacitance: 10uF Tolerance: ±10% Rated Voltage: 50V Temperature Coefficient: X7R Operating Temperature: -55°C ~ -125°C Package/Case: 1206 (3216 Metric) Datasheet(s): CL Series, MLCC Datasheet <https://media.digikey.com/pdf/Data%20Sheets/Samsung%20PDFs/CL_Series_MLCC_ds.pdf> Vendor(s): Digikey: 1276-6767-1-ND <https://www.digikey.com/product-detail/en/samsung-electro-mechanics-america-inc/CL31B106KBHNNNE/1276-6767-1-ND/5961626>; POPULATE: YES; VERIFIED: NO
D1 = openag-diodes:SMAJ14A: TVS DIODE 14VWM 23.2VC SMA - Littlefuse - SMAJ14A - SMAJ14ALFCT-ND Description: The SMAJ series is designed specifically to protect sensitive electronic equipment from voltage transients induced by lightning and other transient voltage events Technical Specifications: Type: Zener Voltage - Reverse Standoff (Typ): 14V Voltage - Breakdown (Min): 15.6V Voltage - Clamping (Max) @ Ipp: 23.2V Current - Peak Pulse (10/1000�s): 17.2A Operating Temperature: -55�C ~ 150�C (TJ) Mounting Type: Surface Mount Package / Case: DO-214AC, SMA Datasheet(s): SMAJ Series <http://www.littelfuse.com/~/media/electronics/datasheets/tvs_diodes/littelfuse_tvs_diode_smaj_datasheet.pdf.pdf> Vendor(s): Digikey: SMAJ14ALFCT-ND <https://www.digikey.com/product-detail/en/littelfuse-inc/SMAJ14A/SMAJ14ALFCT-ND/762486>; POPULATE: YES; VERIFIED: NO
D2-D4 = openag-diodes:APT1608CGCK: Kingbright - APT1608CGCK - LED GREEN CLEAR 0603 SMD Description: Green 570nm LED Indication - Discrete 2.1V 0603 (1608 Metric) Technical Specifications: Color: Green Lens Color: Colorless Lens Transparency: Clear Millicandela Rating: 50mcd Lens Style/Size: Rectangle with Flat Top, 1.20mm x 0.80mm Voltage - Forward (Vf) (Typ): 2.1V Current - Test: 20mA Viewing Angle: 120° Mounting Type: Surface Mount Wavelength - Dominant: 570nm Wavelength - Peak: 574nm Package / Case: 0603 (1608 Metric) Supplier Device Package: Chip LED Size / Dimension: 1.60mm L x 0.80mm W Height (Max): 0.75mm Datasheet(s): APT1608CGCK <http://www.kingbrightusa.com/images/catalog/SPEC/APT1608CGCK.pdf> Vendor(s): Digikey: 754-1116-1-ND <https://www.digikey.com/product-detail/en/kingbright/APT1608CGCK/754-1116-1-ND/1747833#>; POPULATE: YES; VERIFIED: NO
F11 = openag-fuses:SST_7: Bel Fuse - SST7 - FUSE BRD MNT 7A 125VAC/VDC 2SMD Description: FUSE BRD MNT 7A 125VAC/VDC 2SMD Technical Specifications: Current Rating: 7A Voltage Rating: 125V Fuse Type: Board Mount (Cartridge Style Excluded) Mounting Type: Surface Mount Operating Temperature: -55�C ~ 125�C Datasheet(s): SST Type <https://belfuse.com/resources/StewartConnector/SST.pdf> Vendor(s): Digikey: 507-1072-1-ND <https://www.digikey.com/product-detail/en/bel-fuse-inc/SST-7/507-1072-1-ND/615026>; POPULATE: YES; VERIFIED: NO
F12 = fuse:GSH15: FUSE HOLDER grid 15mm, 19649 Wickmann; MPN: 64900001039; OC_FARNELL: 1271673; OC_NEWARK: 02P0318
IC2-IC9 = PCA9615DP:PCA9615DP: Buffer, ReDriver 2 Channel 400kHz 10-TSSOP Source: Datasheet <http://www.nxp.com/docs/en/data-sheet/PCA9615.pdf>; DESCRIPTION: Buffer, ReDriver 2 Channel 400kHz 10-TSSOP; HEIGHT: 1.1mm; MANUFACTURER_NAME: Nexperia; MANUFACTURER_PART_NUMBER: PCA9615DP; SUPPLIER_NAME: RS
J1 = openag-connectors:87583-2010BLF; MANUFACTURER_PART_NUMBER: 875832010BLF; VENDOR: Amphenol FCI
J2-J9 = openag_connector:OPENAG-V1-RJ45: Amphenol FCI - 54602-908LF - CONN MOD JACK 8P8C R/A UNSHLD Description: Jack Modular Connector 8p8c (RJ45, Ethernet) 90� Angle (Right) Unshielded Cat3 Technical Specifications: Connector Type: Jack Number of Positions/Contacts: 8p8c (RJ45, Ethernet) Number of Ports: 1 Number of Rows: 1 Mounting Type: Through Hole Orientation: 90� Angle (Right) Termination: Solder Shielding: Unshielded Ratings: Cat3 Features: Board Lock LED Color: Does Not Contain LED Tab Direction: Down Contact Material: Copper Alloy Contact Finish: Gold Contact Finish Thickness: 15�in (0.38�m) Housing Material: Polyester, Glass Filled Operating Temperature: -40�C ~ 70�C Datasheet(s): 54601-x04(zzz)WPLF Drawing <http://cdn.amphenol-icc.com/media/wysiwyg/files/drawing/c-bmj-0102.pdf> Vendor(s): Digikey: 609-1046-ND <https://www.digikey.com/product-detail/en/amphenol-fci/54602-908LF/609-1046-ND/1001360>; POPULATE: YES; VERIFIED: NO
R1 R16-R79 = rcl:R-US_: RESISTOR, American symbol; SPICEPREFIX: R
R2-R9 = SparkFun-Resistors:10KOHM-1/10W-1%(0603): RES-00824; PROD_ID: RES-00824
R10-R12 = openag-resistors:100OHM-RC0603JR-07100RL: Yageo - RC0603JR-07100RL - RES SMD 100 OHM 5% 1/10W 0603 Description: 100 Ohms ±5% 0.1W, 1/10W Chip Resistor 0603 (1608 Metric) Moisture Resistant Thick Film Technical Specifications: Resistance: 100 Ohms Tolerance: ±5% Power (Watts): 0.1W, 1/10W Composition: Thick Film Features: Moisture Resistant Temperature Coefficient: ±100ppm/°C Operating Temperature: -55°C ~ 155°C Package / Case: 0603 (1608 Metric) Supplier Device Package: 0603 Size / Dimension: 0.063" L x 0.032" W (1.60mm x 0.80mm) Height - Seated (Max): 0.022" (0.55mm) Number of Terminations: 2 Datasheet(s): Thick Film Chip Resistor Intro <http://www.yageo.com.tw/exep/pages/download/literatures/PYu-R_INT-thick_7.pdf> Chip Resistor Marking <http://www.yageo.com/exep/pages/download/literatures/PYu-R_Marking_2.pdf> RC Series, L Datasheet <http://www.yageo.com/documents/recent/PYu-RC_Group_51_RoHS_L_8.pdf> Vendor(s): Digikey: 311-100GRCT-ND <https://www.digikey.com/product-detail/en/yageo/RC0603JR-07100RL/311-100GRCT-ND/729644>; POPULATE: YES; VALUE: 100 OHM; VERIFIED: NO
R13 R86 R87 = openag-resistors:0OHM-RC0603JR-070RL: Yageo - RC0603JR-070RL - RES SMD 0 OHM JUMPER 1/10W 0603 Description: 0 Ohms Jumper 0.1W, 1/10W Chip Resistor 0603 (1608 Metric) Moisture Resistant Thick Film Technical Specifications: Resistance: 0 Ohms Power: 0.1W, 1/10W Operating Temperature: -55°C ~ 155°C Package / Case: 0603 (1608 Metric) Datasheet(s): RC Series, L Datasheet <http://www.yageo.com/documents/recent/PYu-RC_Group_51_RoHS_L_8.pdf> Vendor(s): Digikey: 311-0.0GRCT-ND <https://www.digikey.com/product-detail/en/yageo/RC0603JR-070RL/311-0.0GRCT-ND/729622>; POPULATE: YES; VERIFIED: NO
T1 = R-78E5.0-1.0:R-78E5.0-1.0: Non-Isolated DC/DC Converters 8-28Vin 5V 1.0A THRU <https://componentsearchengine.com/Images/1/R-78E5.0-1.0.jpg> Source: Datasheet <http://www.recom-power.com/pdf/Innoline/R-78Exx-1.0.pdf>; DESCRIPTION: Non-Isolated DC/DC Converters 8-28Vin 5V 1.0A THRU; HEIGHT: mm; MANUFACTURER_NAME: RECOM Power; MANUFACTURER_PART_NUMBER: R-78E5.0-1.0; RS_PART_NUMBER: 1446290; SUPPLIER_NAME: RS
U1 = OpenAG_I2C:TCA9548APWR; MANUFACTURER_PART_NUMBER: TCA9548APWR; VENDOR: TEXAS INSTRUMENTS
U2 = openag-microcontrollers:PHOTONH: PARTICLE - PHOTONH - Tiny Wi-Fi dev board w/cloud backend Description: The Photon is a $19 tiny Wi-Fi development kit for creating connected projects and products for the Internet of Things. It's easy to use, it's powerful, and it's connected to the cloud. Technical Specifications: Processor: STM32F205RGY6 120Mhz ARM Cortex M3 Wireless: 802.11b/g/n Wi-Fi Peripherals: Digital(x18), ADC(x8), DAC(x2), SPI(x2), I2S(x1), I2C(x1) SPI, CAN(1), USB(1), PWM(9) Memory: 1MB flash, 128KB RAM Cerfifications: FCC, CE and IC Operating Temperature: -20°C ~ 60°C Humidity Range: Non condensing, relative humidity: 95% Supply Input Voltage (VIN): 3.6V ~ 5.5V Supply Input Voltage (3V3): 3.0V ~ 3.6V Max Supply Output Current (VIN): 1A Max Supply Output Current (3V3): 100mA Average Operating Current (WiFi on, @VIN): up to 100mA Peak Operating Current (WiFi on, @VIN): up to 430mA I/O Max Source/Sink Current (Individual): 25mA I/O Max Source/Sinnk Current (Total): 120mA Datasheet(s): Photon Datasheet <https://docs.particle.io/datasheets/photon-datasheet/> Vendor(s): Particle: PHOTONH <https://store.particle.io/products/photon>; POPULATE: YES; VERIFIED: NO
U$1 U$3 = PJ-036ah:PJ-036AH
U$2 = SparkFun-Boards:BEAGLE_BONE_BLACK_CAPE